# EasyEDA Pro project ProProject_Hollow-Clock-Pro_2024-01-11.epro

# Schematic SCH1
Create Date: 2023-07-30; Page Name: P1; Project Name: Hollow-Clock-Pro; Schematic Name: Schematic1; Update Date: 2023-07-30; Company: 嘉立创EDA; Page Size: A4; Version: V1.0
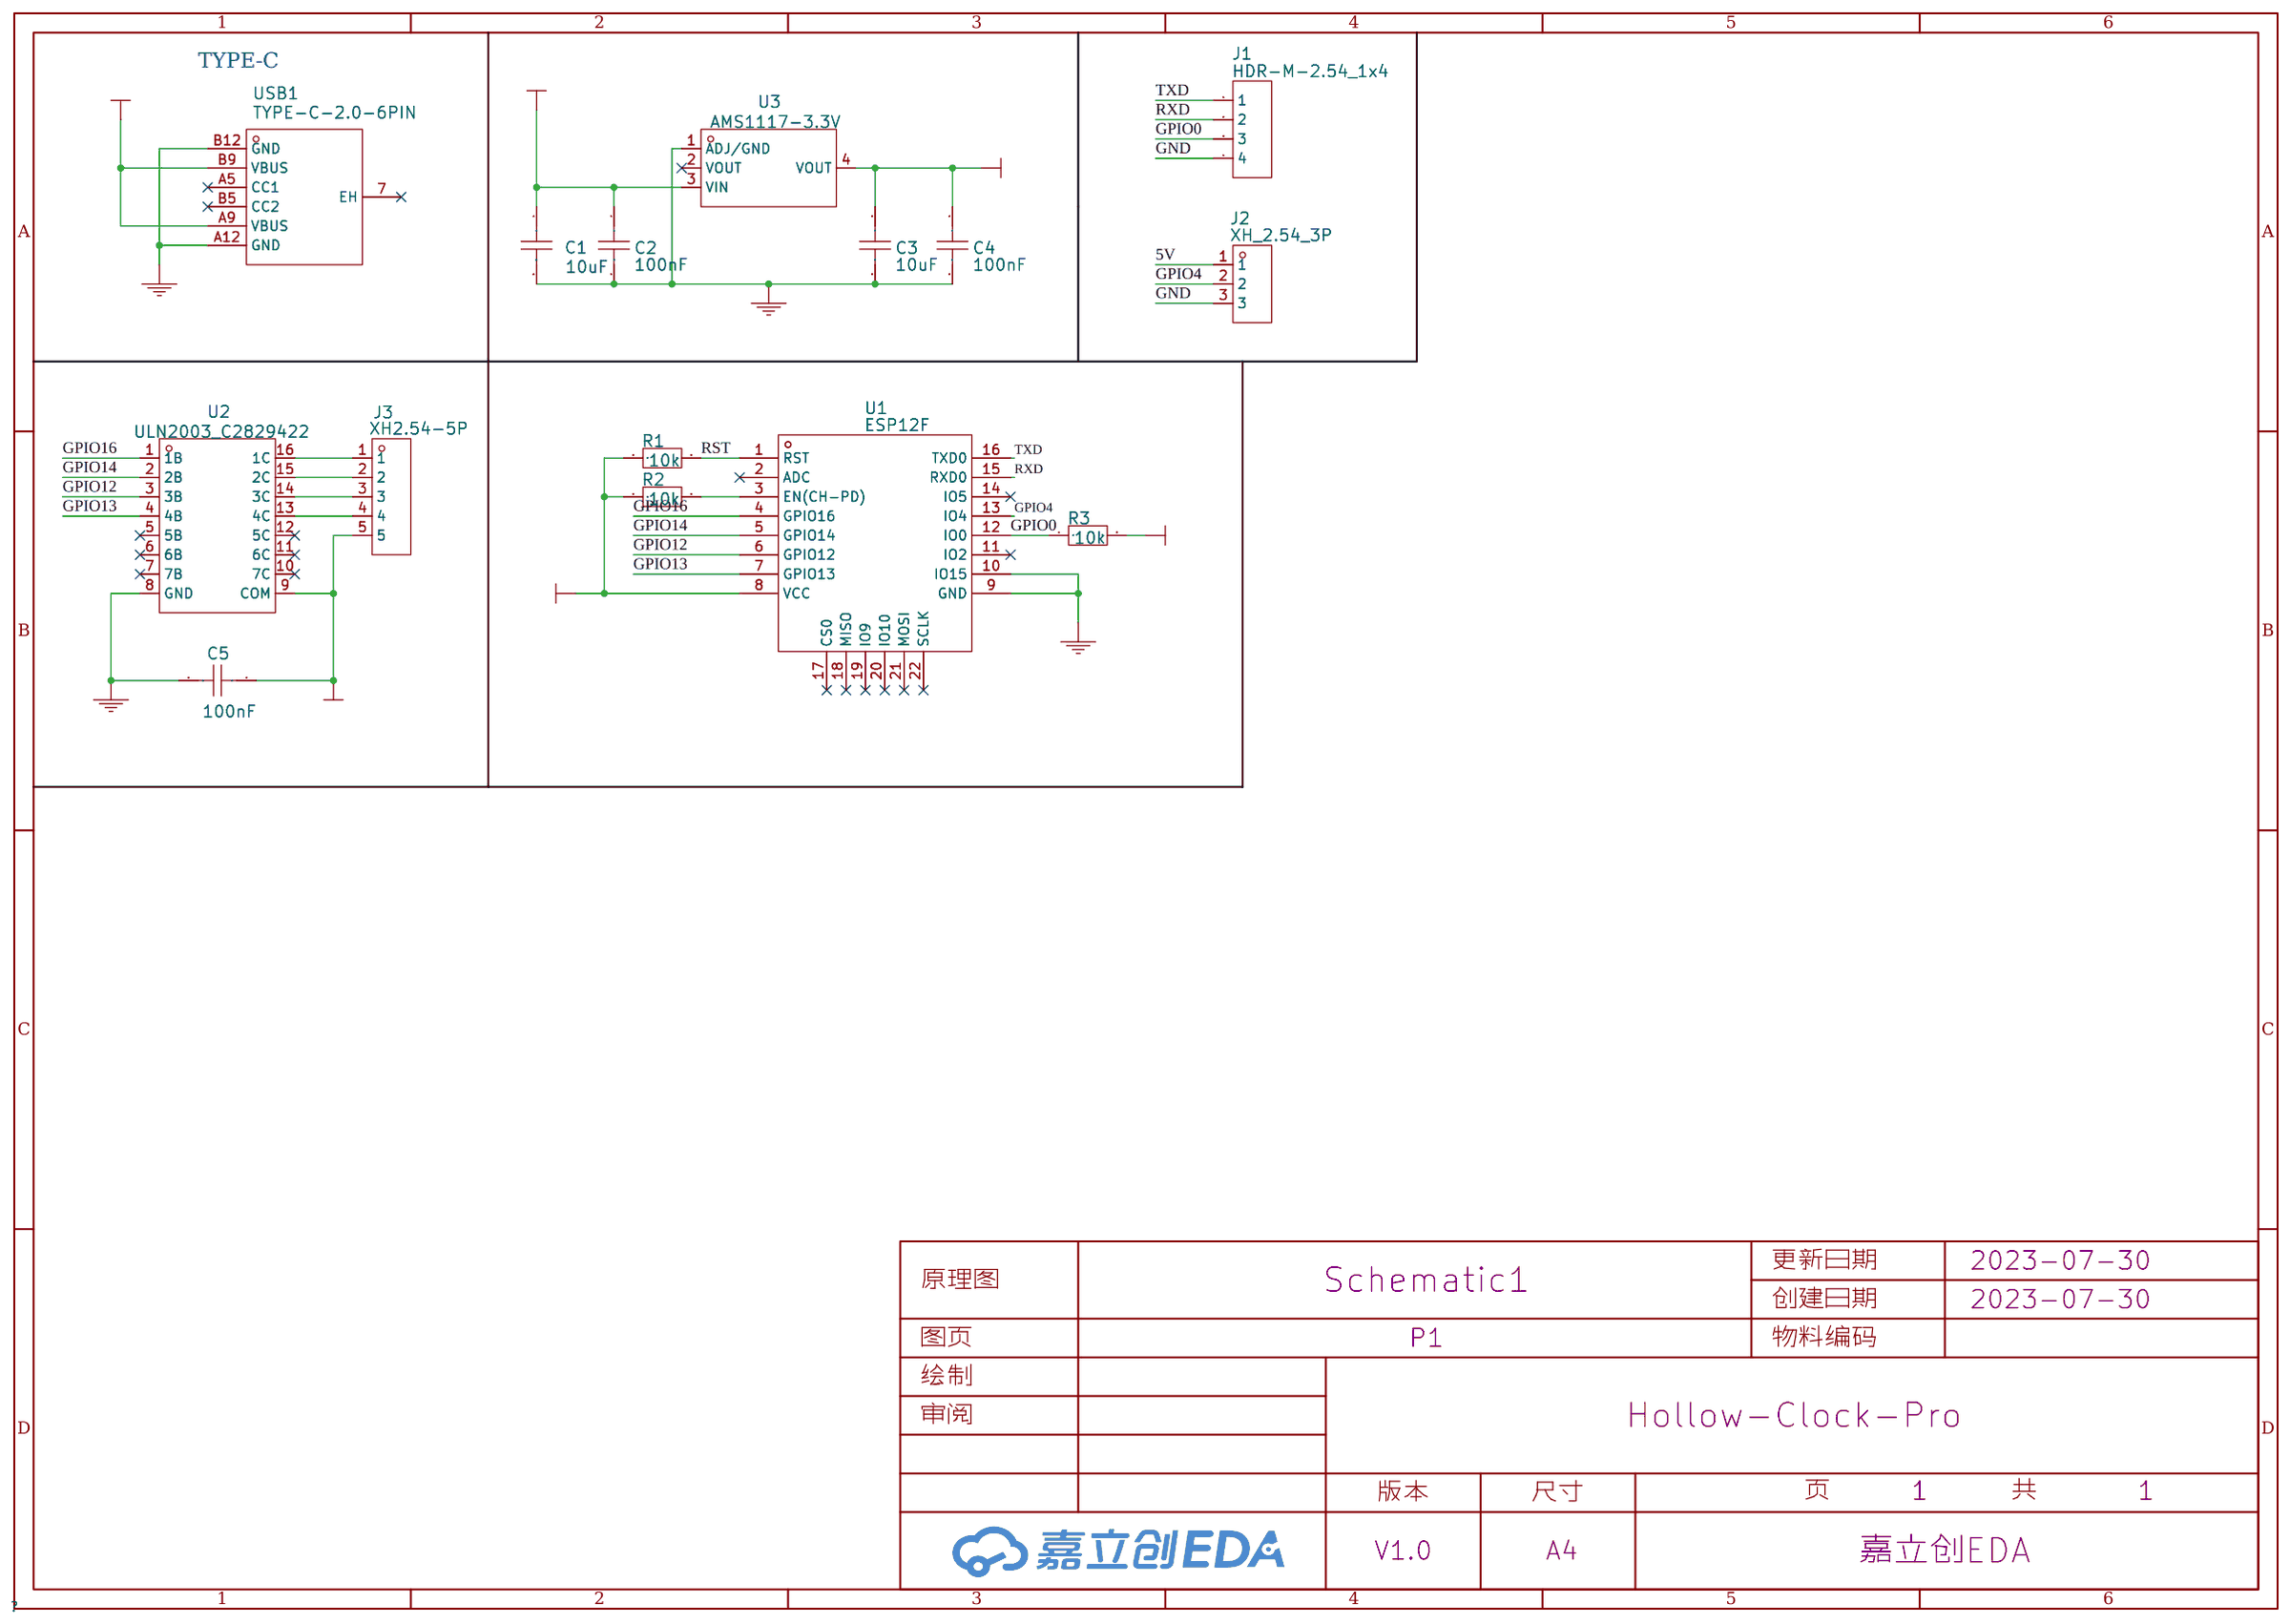
[diagram p0: schematic sheet]

## Parts
C1  10uF  [C0603]
C2  100nF  [C0603]
C3  10uF  [C0603]
C4  100nF  [C0603]
C5  100nF  [C0603]
J1  HDR-M-2.54_1x4  [HDR-M-2.54_1X4]
J2  XH_2.54_3P  [CONN-TH_XH2.54-3P]
J3  XH2.54-5P  [CONN-TH_XH2.54-5P]
R1  10k  [R0603]
R2  10k  [R0603]
R3  10k  [R0603]
U1  ESP12F  [ESP12F/S]
U2  ULN2003_C2829422  [SOP-16_L9.9-W3.9-P1.27-LS6.0-BL]
U3  AMS1117-3.3V  [SOT-223-4_L6.5-W3.5-P2.30-LS7.0-BR]
USB1  TYPE-C-2.0-6PIN  [TYPE-C-SMD_TYPE-C-6P-2]

## Library data of the parts
C1 C3 = 10uF
C2 C4 C5 = 100nF
J1 = HDR-M-2.54_1x4: Supplier Part: C124378; Supplier: LCSC
J2 = XH_2.54_3P: Supplier: LCSC; Supplier Part: C9900004241; Manufacturer: null; JLCPCB Part Class: Extended Part
J3 = XH2.54-5P 直插: Supplier: LCSC; Supplier Part: C9900000728; Manufacturer: null; JLCPCB Part Class: Extended Part
R1-R3 = 10k
U1 = ESP12F
U2 = ULN2003: Supplier: LCSC; Supplier Part: C2829422; Manufacturer: CJ(江苏长电/长晶); JLCPCB Part Class: Extended Part
U3 = AMS1117-3.3V: Supplier: LCSC; Supplier Part: C2688239; Manufacturer: WPMtek(维攀微); JLCPCB Part Class: Extended Part
USB1 = Type-C-2.0-6Pin: Supplier: LCSC; Supplier Part: C2987385; Manufacturer: CIKI(皓富); JLCPCB Part Class: Extended Part

## Nets
3.3V: C3.1 C4.1 R1.1 R2.1 R3.2 U1.8(VCC) U3.4(VOUT)
5V: C1.1 C2.1 C5.1 J2.1 J3.5 U2.9(COM) U3.3(VIN) USB1.A9(VBUS) USB1.B9(VBUS)
GND: C1.2 C2.2 C3.2 C4.2 C5.2 J1.4 J2.3 U1.9(GND) U1.10(IO15) U2.8(GND) U3.1(ADJ/GND) USB1.A12(GND) USB1.B12(GND)
GPIO0: J1.3 R3.1 U1.12(IO0)
GPIO4: J2.2 U1.13(IO4)
GPIO12: U1.6(GPIO12) U2.3(3B)
GPIO13: U1.7(GPIO13) U2.4(4B)
GPIO14: U1.5(GPIO14) U2.2(2B)
GPIO16: U1.4(GPIO16) U2.1(1B)
RST: R1.2 U1.1(RST)
RXD: J1.2 U1.15(RXD0)
TXD: J1.1 U1.16(TXD0)
U1_3: R2.2 U1.3(EN(CH-PD))
U2_13: J3.4 U2.13(4C)
U2_14: J3.3 U2.14(3C)
U2_15: J3.2 U2.15(2C)
U2_16: J3.1 U2.16(1C)

Not connected (* = marked no-connect by the designer): U1 2(ADC)* 11(IO2)* 14(IO5)* 17(CS0)* 18(MISO)* 19(IO9)* 20(IO10)* 21(MOSI)* 22(SCLK)*; U2 5(5B)* 6(6B)* 7(7B)* 10(7C)* 11(6C)* 12(5C)*; U3 2(VOUT)*; USB1 7(EH)* A5(CC1)* B5(CC2)*

## Notes on the sheet
- TYPE-C

# Board PCB1
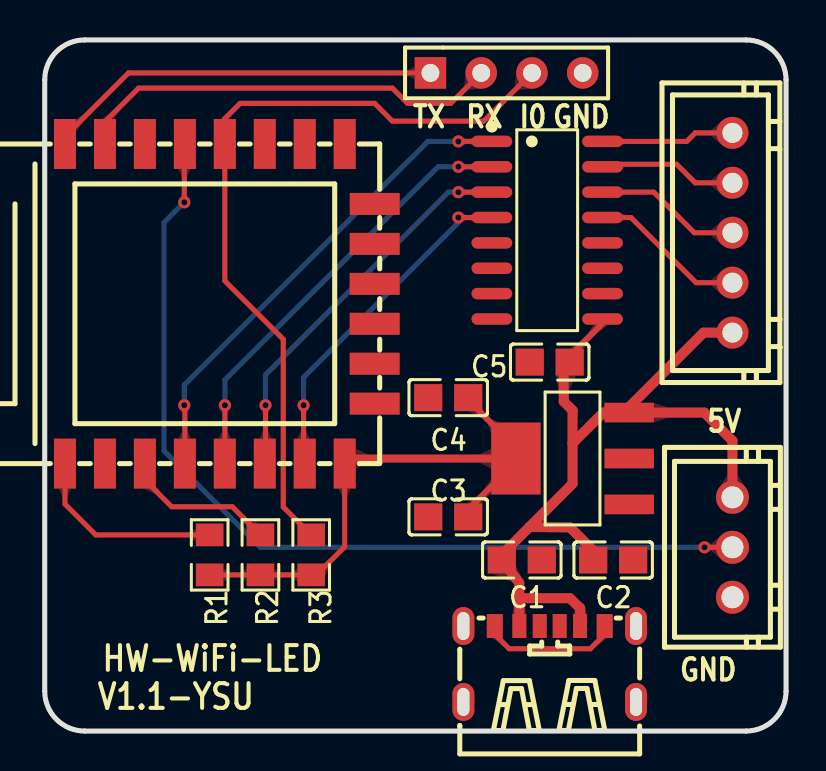
[diagram p1: board, top side]
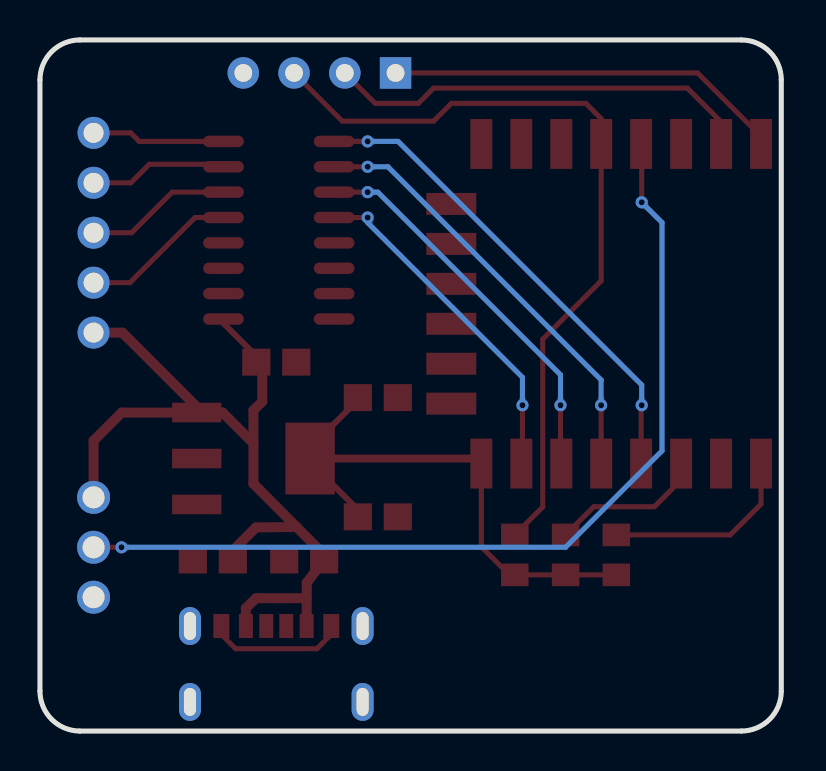
[diagram p2: board, bottom side, seen from below]

Outline 37.1 x 34.6 mm; copper layers: Top Layer, Inner3, Inner4, Inner5, Inner6, Inner7, Inner8, Inner9, Inner10, Inner11, Inner12, Inner13, Inner14, Inner15, Inner16, Inner17, Inner18, Inner19, Inner20, Inner21, Inner22, Inner23, Inner24, Inner25, Inner26, Inner27, Inner28, Inner29, Inner30, Bottom Layer. Coordinates in mm from the lower left corner of the outline.
Outline path: 0,32.6 arc(0.59,34.01) 2,34.6 35.1,34.6 arc(36.51,34.01) 37.1,32.6 37.1,2 arc(36.51,0.59) 35.1,0 2,0 arc(0.59,0.59) 0,2 0,32.6
Stack: Top Layer 0.035mm / Dielectric1 1.51mm FR4 er 4.5 / Bottom Layer 0.035mm

## Design rules (mm)
template: JLCPCB Capability(Two Layers Board)
spacing copperThickness1oz (default): track to track 0.102, other pairs 0.152 to 0.3
spacing copperThickness2oz: track to track 0.203, other pairs 0.152 to 0.3
track width copperThickness1oz (default): min 0.127, default 0.254, max 2.54
track width copperThickness2oz: min 0.203, default 0.254, max 2.54
differential pair differentialPair (default): width min 0.127, default 0.254, max 2.54; gap min 0.152, default 0.152
via viaSize (default): diameter min 0.5, default 0.61, max 10; hole min 0.3, default 0.305, max 6.3

## Placement (name value [footprint] x y rotation side)
C1  10uF  [C0805]  23.88 8.56 0 top
C2  100nF  [C0805]  28.45 8.56 0 top
C3  10uF  [C0805]  20.19 10.72 180 top
C4  100nF  [C0805]  20.19 16.69 180 top
C5  100nF  [C0805]  25.27 18.47 180 top
J1  HDR-M-2.54_1x4  [HDR-M-2.54_1X4]  23.11 32.95 0 top
J2  XH_2.54_3P  [CONN-TH_XH2.54-3P]  34.42 9.2 270 top
J3  XH2.54-5P  [CONN-TH_XH2.54-5P]  34.42 24.95 270 top
R1  10k  [R0805]  8.25 8.82 90 top
R2  10k  [R0805]  10.79 8.82 90 top
R3  10k  [R0805]  13.33 8.82 270 top
U1  ESP12F  [ESP12F/S]  8.76 21.39 90 top
U2  ULN2003_C2829422  [SOP-16_L9.9-W3.9-P1.27-LS6.0-BL]  25.15 25.08 270 top
U3  AMS1117-3.3V  [SOT-223-4_L6.5-W3.5-P2.30-LS7.0-BR]  26.42 13.64 0 top
USB1  TYPE-C-2.0-6PIN  [TYPE-C-SMD_TYPE-C-6P-2]  25.27 3.36 0 top

## Footprints (pads in the part's own frame, mm; a bottom-side part is the same pattern mirrored in y, then rotated)
C0805
  rect 1.41x1.35 smd: 1(-1,0) 2(1,0)
CONN-TH_XH2.54-3P
  round 1.65 hole 1.1: 1(-2.5,0) 2(0,0) 3(2.5,0)
CONN-TH_XH2.54-5P
  round 1.6 hole 1: 1(-5,0) 2(-2.5,0) 3(0,0) 4(2.5,0) 5(5,0)
ESP12F/S
  rect 2.5x1.1 smd: 1(-8.002,7.75) 2(-8.002,5.75) 3(-8.002,3.751) 4(-8.002,1.75) 5(-8.002,-0.249) 6(-8.002,-2.249) 7(-8.002,-4.25) 8(-8.001,-6.25) 9(7.998,-6.25) 10(8,-4.25) 11(8.002,-2.249) 12(8.001,-0.249) 13(8,1.75) 14(8.001,3.751) 15(8.001,5.75) 16(8.001,7.75)
  rect 1.1x2.5 smd: 17(-5,-7.75) 18(-3.002,-7.749) 19(-1.003,-7.75) 20(0.998,-7.75) 21(2.997,-7.75) 22(4.997,-7.75)
HDR-M-2.54_1X4
  rect 1.575x1.575 hole 0.889: 1(-3.81,0)
  round 1.575 hole 0.889: 2(-1.27,0) 3(1.27,0) 4(3.81,0)
R0805
  rect 1.133x1.377 smd: 1(-1,0) 2(1,0)
SOP-16_L9.9-W3.9-P1.27-LS6.0-BL
  oval 0.574x2.038 smd: 1(-4.445,-2.769) 2(-3.175,-2.769) 3(-1.905,-2.769) 4(-0.635,-2.769) 5(0.635,-2.769) 6(1.905,-2.769) 7(3.175,-2.769) 8(4.445,-2.769) 9(4.445,2.769) 10(3.175,2.769) 11(1.905,2.769) 12(0.635,2.769) 13(-0.635,2.769) 14(-1.905,2.769) 15(-3.175,2.769) 16(-4.445,2.769)
SOT-223-4_L6.5-W3.5-P2.30-LS7.0-BR
  rect 2.47x0.98 smd: 1(2.835,-2.3) 2(2.835,0) 3(2.835,2.3)
  rect 2.47x3.6 smd: 4(-2.835,0)
TYPE-C-SMD_TYPE-C-6P-2
  oval 1.1x1.9 hole 0.6x1.4: 7(-4.32,1.9) 8(4.32,1.9) 9(-4.32,-1.9) 10(4.32,-1.9)
  rect 0.7x1.2 smd: A5(-0.5,1.9) A9(1.52,1.9) B5(0.5,1.9) B9(-1.52,1.9)
  rect 0.8x1.2 smd: A12(2.75,1.9) B12(-2.75,1.9)

## Nets
As in the schematic.

Pads without a net: U1 2 11 14 17 18 19 20 21 22; U2 5 6 7 10 11 12; U3 2; USB1 7 8 9 10 A5 B5

## Via types
v1: diameter 0.61, hole 0.305, Top Layer to Bottom Layer, 10 vias

## Routing (per net, layer and track width the routed paths; a pad name or vN(x,y) marks a point on that pad's centre or on a via; arc(x,y) is an arc through that point)
3.3V: length 28.6
  Top Layer w0.254: 15.01,13.39 15.01,9.23 13.6,7.82 R3.2 R2.1 R1.1
  Top Layer w0.3: C4.1 21.07,16.69 23.1,14.66 23.58,14.66 U3.4 ; C3.1 21.36,11.26 23.62,13.52
  Top Layer w0.4: U3.4 15.02,13.64 ; 15.01,13.64 15.01,13.39
5V: length 46
  Top Layer w0.3: U2.9 27.91,20.41 25.97,18.47
  Top Layer w0.5: 23.75,5.26 23.75,7.42 22.88,8.56 22.88,8.83 24.26,10.22 ; 25.97,18.47 25.97,16.5 26.42,16.06 26.42,14.41 ; 27.75,8.56 27.75,8.74 26.29,10.2 24.26,10.22 ; 34.02,19.95 34.42,19.95 34.02,19.95 ; 34.02,19.95 32.97,19.95 29.25,16.23 29.25,15.94 ; 24.26,10.22 26.42,12.39 26.42,14.41 ; 26.42,14.41 27.95,15.94 29.25,15.94 ; 29.25,15.94 33.01,15.94 34.42,14.53 J2.1 ; USB1.A9 26.8,6.15 26.28,6.65 23.75,6.65
GND: length 6.9
  Top Layer w0.254: 28.02,5.26 28.02,4.84 27.3,4.12 23.24,4.12 22.52,4.84 22.52,5.26
GPIO0: length 39.8
  Top Layer w0.254: 13.21,9.95 11.94,11.22 11.94,19.61 9.01,22.54 9.01,29.39 9.02,30.66 9.78,31.42 16.51,31.42 17.4,30.54 21.97,30.54 J1.3 ; 13.21,9.95 13.33,9.82 ; 13.21,9.95 13.21,10.08
GPIO4: length 46.2
  Top Layer w0.254: v1(6.98,26.47) 6.98,29.36 7.01,29.39 ; J2.2 v1(33.02,9.2)
  Bottom Layer w0.254: v1(33.02,9.2) 10.79,9.2 5.97,14.03 5.97,25.46 v1(6.98,26.47)
GPIO12: length 19.6
  Top Layer w0.254: U1.6 11.05,13.39 v1(11.05,16.31) ; U2.3 v1(20.7,26.98)
  Bottom Layer w0.254: v1(20.7,26.98) 20.19,26.98 11.05,17.84 v1(11.05,16.31)
GPIO13: length 17.3
  Top Layer w0.254: U2.4 v1(20.7,25.71) ; v1(12.95,16.31) 12.95,13.39 U1.7
  Bottom Layer w0.254: v1(20.7,25.71) 20.7,25.46 12.95,17.71 v1(12.95,16.31)
GPIO14: length 22
  Top Layer w0.254: U2.2 v1(20.7,28.25) ; v1(9.02,16.31) U1.5
  Bottom Layer w0.254: v1(9.02,16.31) 9.02,17.58 19.69,28.25 v1(20.7,28.25)
GPIO16: length 24.4
  Top Layer w0.254: U2.1 v1(20.7,29.52) ; v1(6.98,16.31) 7.01,16.28 U1.4
  Bottom Layer w0.254: v1(20.7,29.52) 19.18,29.52 6.98,17.33 v1(6.98,16.31)
RST: length 9.9
  Top Layer w0.254: 8.25,9.82 2.55,9.82 1.01,11.36 U1.1
RXD: length 21.6
  Top Layer w0.254: J1.2 20.32,31.42 18.16,31.42 17.4,32.19 4.7,32.19 3.01,30.5 3.01,29.39
TXD: length 20
  Top Layer w0.254: J1.1 4.19,32.95 1.01,29.77 1.01,29.39
U1_3: length 7.7
  Top Layer w0.254: 5.01,13.39 5.01,12.57 6.35,11.23 9.38,11.23 10.79,9.82
U2_13: length 7.9
  Top Layer w0.254: U2.13 29.34,25.71 32.6,22.45 J3.4
U2_14: length 7.3
  Top Layer w0.254: U2.14 30.48,26.98 32.51,24.95 J3.3
U2_15: length 6.9
  Top Layer w0.254: J3.2 32.55,27.45 31.62,28.38 28.04,28.38 U2.15
U2_16: length 6.7
  Top Layer w0.254: U2.16 32.13,29.52 32.56,29.95 34.42,29.95

## Copper pours and planes (outline as drawn; the poured copper is in the pictures)
GND on Top Layer: 40.64,37.14 40.64,-0.96 -2.54,-0.96 -2.54,37.14

Small or netless copper shapes (teardrops, artwork), in the pictures only: 61 on Top Layer, 10 on Bottom Layer

## Text on the board
Top Silkscreen Layer: TX | RX | I0 | GND | 5V | V1.1-YSU | HW-WiFi-LED
